# EAGLE design Arduino_MEGA_2560-Rev3_Shield (EAGLE 7.5.0)
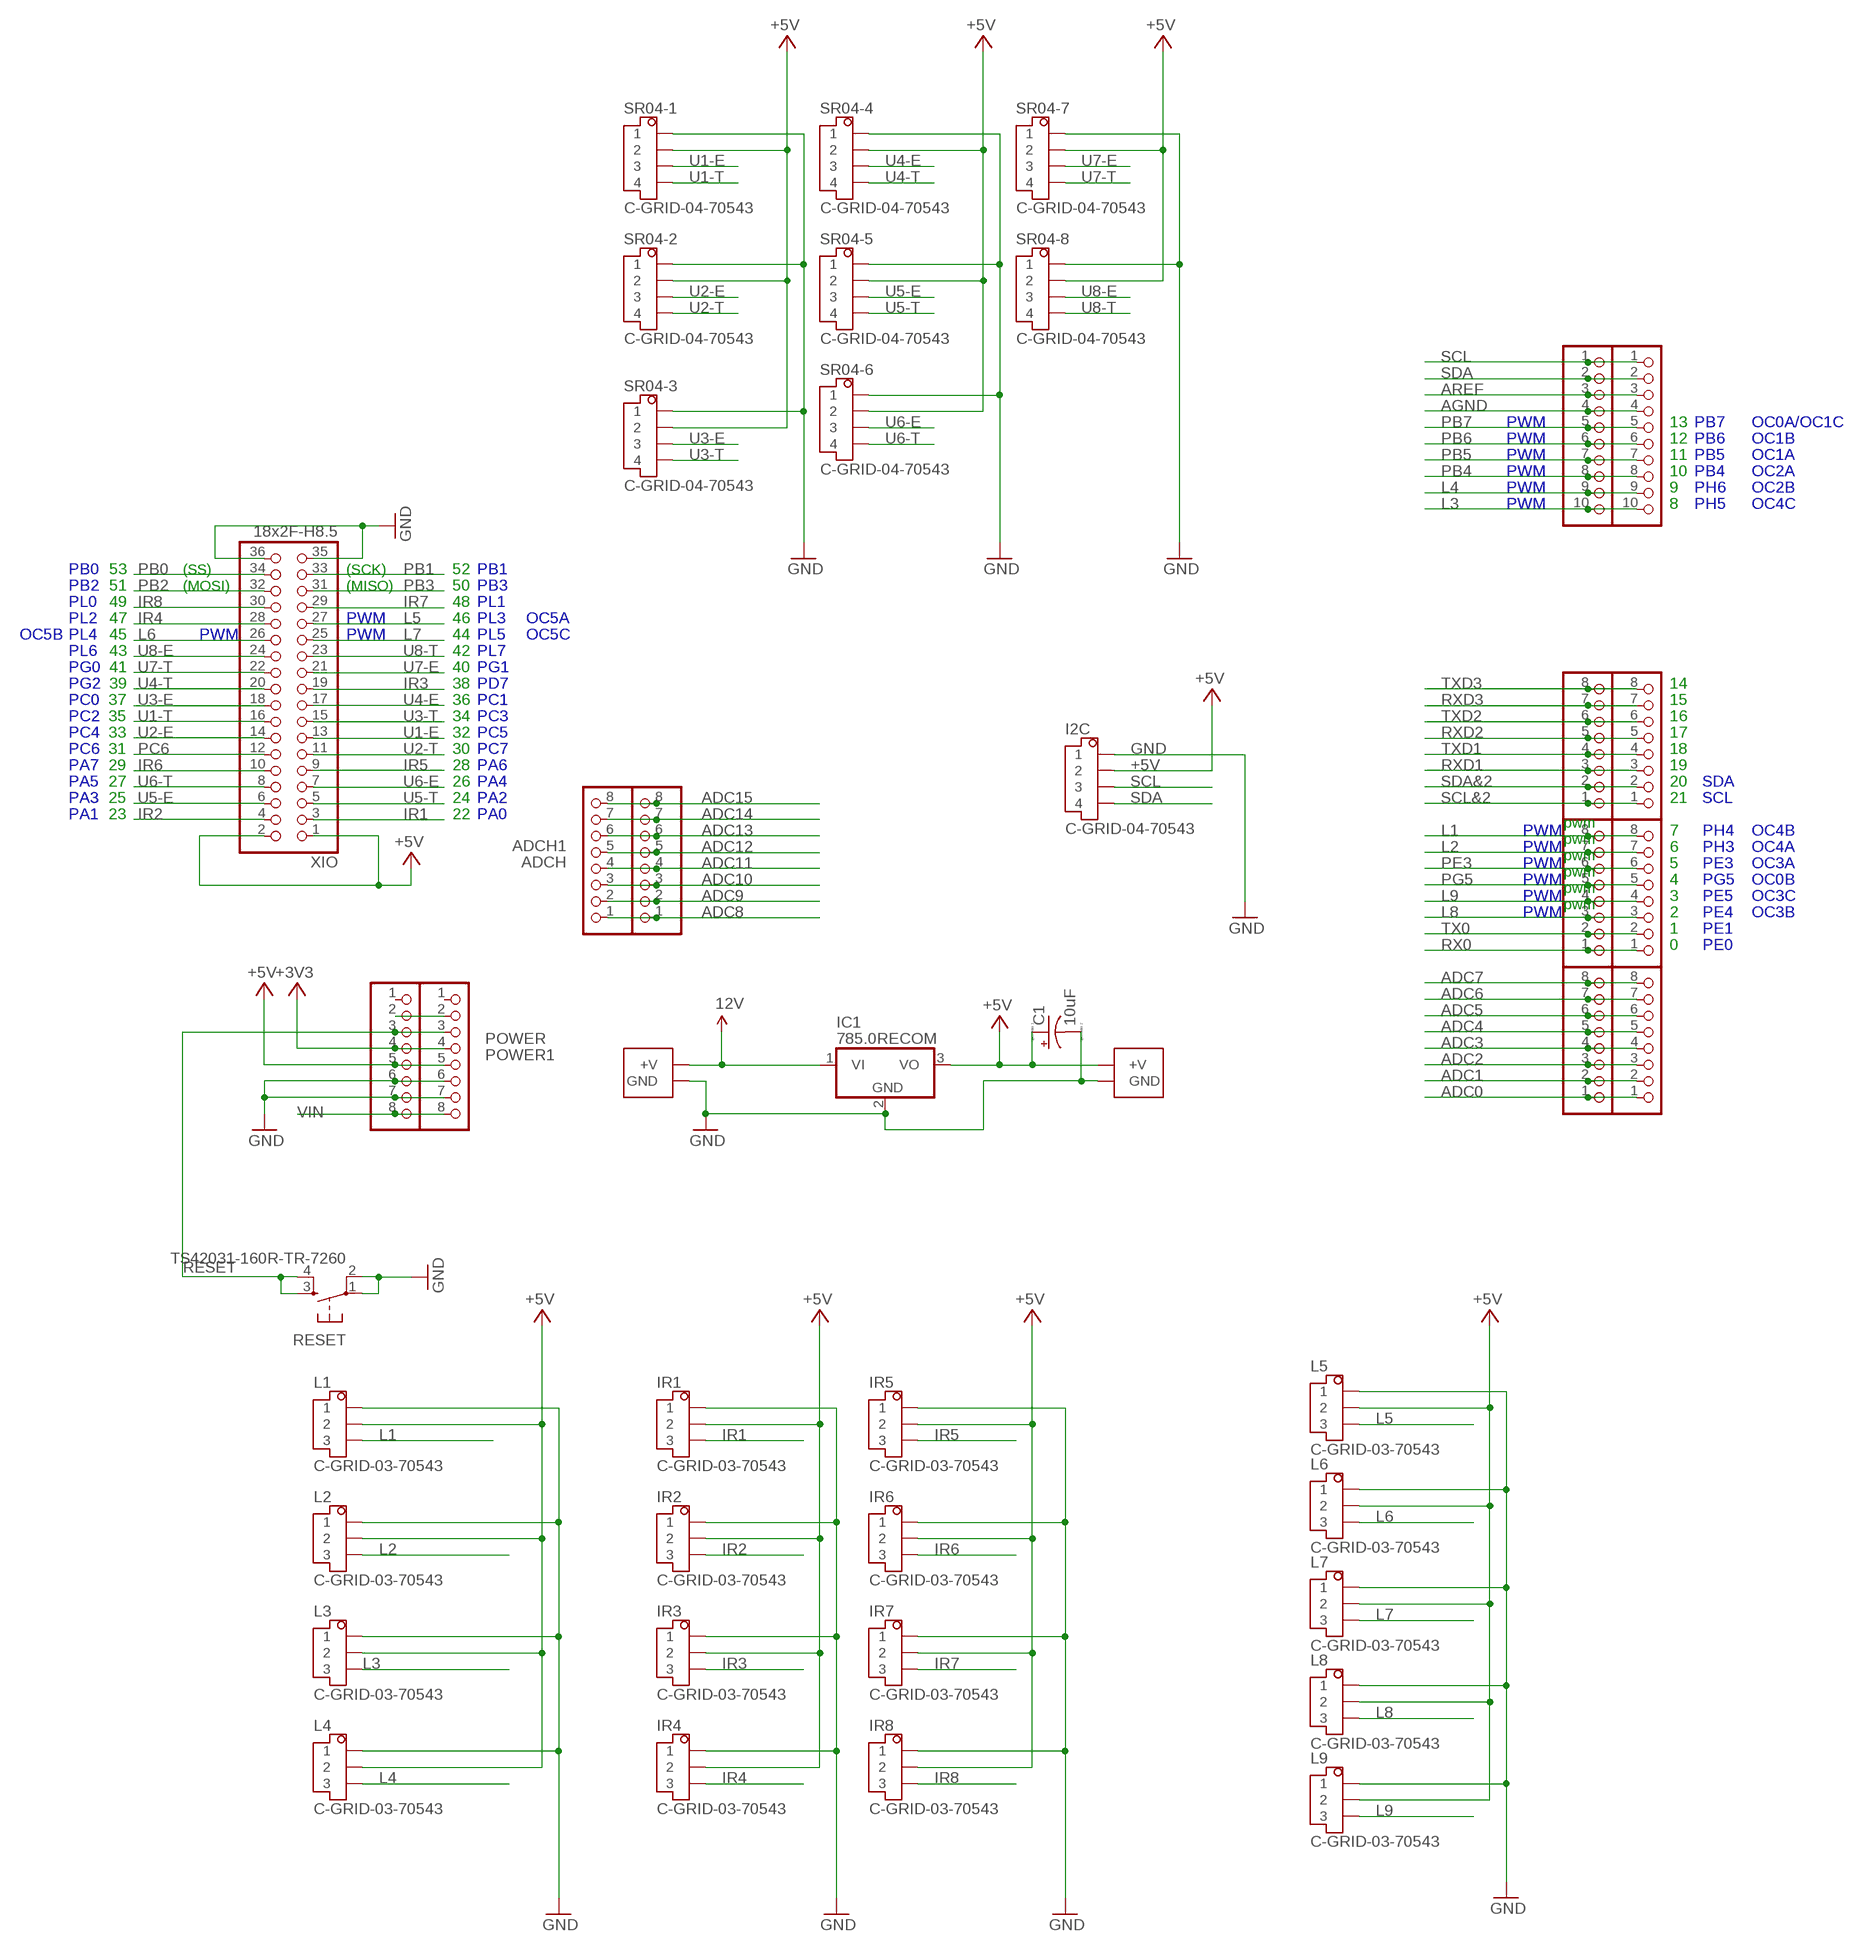
[diagram p0: schematic, sheet 1]

## Parts
ADCH  8x1F-H8.5  PINHD-1X8  [1X08]
ADCH1  8x1F-H8.5  PINHD-1X8  [1X08]
ADCL  8x1F-H8.5  PINHD-1X8  [1X08]
ADCL1  8x1F-H8.5  PINHD-1X8  [1X08]
C1  10uF  CPOL-USCT6032  [CT6032]
COMMUNICATION  8x1F-H8.5  PINHD-1X8  [1X08]
COMMUNICATION1  8x1F-H8.5  PINHD-1X8  [1X08]
I2C  C-GRID-04-70543  [70543-04]
IC1  785.0RECOM  [RECOM-78E]
IR1  C-GRID-03-70543  [70543-03]
IR2  C-GRID-03-70543  [70543-03]
IR3  C-GRID-03-70543  [70543-03]
IR4  C-GRID-03-70543  [70543-03]
IR5  C-GRID-03-70543  [70543-03]
IR6  C-GRID-03-70543  [70543-03]
IR7  C-GRID-03-70543  [70543-03]
IR8  C-GRID-03-70543  [70543-03]
JP1  10x1F-H8.5  PINHD-1X10_ARD  [1X10]
JP6  10x1F-H8.5  PINHD-1X10_ARD  [1X10]
L1  C-GRID-03-70543  [70543-03]
L2  C-GRID-03-70543  [70543-03]
L3  C-GRID-03-70543  [70543-03]
L4  C-GRID-03-70543  [70543-03]
L5  C-GRID-03-70543  [70543-03]
L6  C-GRID-03-70543  [70543-03]
L7  C-GRID-03-70543  [70543-03]
L8  C-GRID-03-70543  [70543-03]
L9  C-GRID-03-70543  [70543-03]
POWER  8x1F-H8.5  PINHD-1X8  [1X08]
POWER1  8x1F-H8.5  PINHD-1X8  [1X08]
PWML  8x1F-H8.5  PINHD-1X8  [1X08]
PWML1  8x1F-H8.5  PINHD-1X8  [1X08]
RESET  TS42031-160R-TR-7260  TAC_SWITCHPTH  [TACTILE-PTH]
SR04-1  C-GRID-04-70543  [70543-04]
SR04-2  C-GRID-04-70543  [70543-04]
SR04-3  C-GRID-04-70543  [70543-04]
SR04-4  C-GRID-04-70543  [70543-04]
SR04-5  C-GRID-04-70543  [70543-04]
SR04-6  C-GRID-04-70543  [70543-04]
SR04-7  C-GRID-04-70543  [70543-04]
SR04-8  C-GRID-04-70543  [70543-04]
U$1  POWERIN  [1825640000]
U$2  POWERIN  [1825640000]
XIO  18x2F-H8.5  PINHD-2X18  [2X18]

## Nets
12V: IC1.1(VI) U$1.B1(+V) U$1.B2(+V)
+3V3 [power]: POWER1.4 POWER.4
+5V [power usb]: C1.+ I2C.2 IC1.3(VO) IR1.2 IR2.2 IR3.2 IR4.2 IR5.2 IR6.2 IR7.2 IR8.2 L1.2 L2.2 L3.2 L4.2 L5.2 L6.2 L7.2 L8.2 L9.2 POWER1.5 POWER.5 SR04-1.2 SR04-2.2 SR04-3.2 SR04-4.2 SR04-5.2 SR04-6.2 SR04-7.2 SR04-8.2 U$2.B1(+V) U$2.B2(+V) XIO.1 XIO.2
ADC0: ADCL1.1 ADCL.1
ADC1: ADCL1.2 ADCL.2
ADC2: ADCL1.3 ADCL.3
ADC3: ADCL1.4 ADCL.4
ADC4: ADCL1.5 ADCL.5
ADC5: ADCL1.6 ADCL.6
ADC6: ADCL1.7 ADCL.7
ADC7: ADCL1.8 ADCL.8
ADC8: ADCH1.1 ADCH.1
ADC9: ADCH1.2 ADCH.2
ADC10: ADCH1.3 ADCH.3
ADC11: ADCH1.4 ADCH.4
ADC12: ADCH1.5 ADCH.5
ADC13: ADCH1.6 ADCH.6
ADC14: ADCH1.7 ADCH.7
ADC15: ADCH1.8 ADCH.8
AGND [gnd]: JP1.4 JP6.4
AREF: JP1.3 JP6.3
GND [gnd]: C1.- I2C.1 IC1.2(GND) IR1.1 IR2.1 IR3.1 IR4.1 IR5.1 IR6.1 IR7.1 IR8.1 L1.1 L2.1 L3.1 L4.1 L5.1 L6.1 L7.1 L8.1 L9.1 POWER1.6 POWER1.7 POWER.6 POWER.7 RESET.1 RESET.2 SR04-1.1 SR04-2.1 SR04-3.1 SR04-4.1 SR04-5.1 SR04-6.1 SR04-7.1 SR04-8.1 U$1.A1(GND) U$1.A2(GND) U$2.A1(GND) U$2.A2(GND) XIO.35 XIO.36
IR1: IR1.3 XIO.3
IR2: IR2.3 XIO.4
IR3: IR3.3 XIO.19
IR4: IR4.3 XIO.28
IR5: IR5.3 XIO.9
IR6: IR6.3 XIO.10
IR7: IR7.3 XIO.29
IR8: IR8.3 XIO.30
L1: L1.3 PWML1.8 PWML.8
L2: L2.3 PWML1.7 PWML.7
L3: JP1.10 JP6.10 L3.3
L4: JP1.9 JP6.9 L4.3
L5: L5.3 XIO.27
L6: L6.3 XIO.26
L7: L7.3 XIO.25
L8: L8.3 PWML1.3 PWML.3
L9: L9.3 PWML1.4 PWML.4
N$7 [power usb]: POWER1.2 POWER.2
PB0: XIO.34
PB1: XIO.33
PB2: XIO.32
PB3: XIO.31
PB4: JP1.8 JP6.8
PB5: JP1.7 JP6.7
PB6: JP1.6 JP6.6
PB7: JP1.5 JP6.5
PC6: XIO.12
PE3: PWML1.6 PWML.6
PG5: PWML1.5 PWML.5
RESET: POWER1.3 POWER.3 RESET.3 RESET.4
RX0: PWML1.1 PWML.1
RXD1: COMMUNICATION1.3 COMMUNICATION.3
RXD2: COMMUNICATION1.5 COMMUNICATION.5
RXD3: COMMUNICATION1.7 COMMUNICATION.7
SCL: I2C.3 JP1.1 JP6.1
SCL&2: COMMUNICATION1.1 COMMUNICATION.1
SDA: I2C.4 JP1.2 JP6.2
SDA&2: COMMUNICATION1.2 COMMUNICATION.2
TX0: PWML1.2 PWML.2
TXD1: COMMUNICATION1.4 COMMUNICATION.4
TXD2: COMMUNICATION1.6 COMMUNICATION.6
TXD3: COMMUNICATION1.8 COMMUNICATION.8
U1-E: SR04-1.3 XIO.13
U1-T: SR04-1.4 XIO.16
U2-E: SR04-2.3 XIO.14
U2-T: SR04-2.4 XIO.11
U3-E: SR04-3.3 XIO.18
U3-T: SR04-3.4 XIO.15
U4-E: SR04-4.3 XIO.17
U4-T: SR04-4.4 XIO.20
U5-E: SR04-5.3 XIO.6
U5-T: SR04-5.4 XIO.5
U6-E: SR04-6.3 XIO.7
U6-T: SR04-6.4 XIO.8
U7-E: SR04-7.3 XIO.21
U7-T: SR04-7.4 XIO.22
U8-E: SR04-8.3 XIO.24
U8-T: SR04-8.4 XIO.23
VIN [power]: POWER1.8 POWER.8
Unconnected: POWER1.1 POWER.1

## Notes on the sheet
- PWM | 13 | PB7 | OC0A/OC1C
- PWM | 12 | PB6 | OC1B
- PWM | 11 | PB5 | OC1A
- PWM | 10 | PB4 | OC2A
- PWM | 9 | PH6 | OC2B
- PWM | 8 | PH5 | OC4C
- PB0 | 53 | (SS) | (SCK) | 52 | PB1
- PB2 | 51 | (MOSI) | (MISO) | 50 | PB3
- PL0 | 49 | 48 | PL1
- PL2 | 47 | PWM | 46 | PL3 | OC5A
- OC5B | PL4 | 45 | PWM | PWM | 44 | PL5 | OC5C
- PL6 | 43 | 42 | PL7
- PG0 | 41 | 40 | PG1
- PG2 | 39 | 38 | PD7 | 14
- PC0 | 37 | 36 | PC1 | 15
- PC2 | 35 | 34 | PC3 | 16
- PC4 | 33 | 32 | PC5 | 17
- PC6 | 31 | 30 | PC7 | 18
- PA7 | 29 | 28 | PA6 | 19
- PA5 | 27 | 26 | PA4 | 20 | SDA
- PA3 | 25 | 24 | PA2 | 21 | SCL
- PA1 | 23 | 22 | PA0
- pwm
- PWM | 7 | PH4 | OC4B
- pwm
- PWM | 6 | PH3 | OC4A
- pwm
- PWM | 5 | PE3 | OC3A
- pwm
- PWM | 4 | PG5 | OC0B
- pwm
- PWM | 3 | PE5 | OC3C
- pwm
- PWM | 2 | PE4 | OC3B
- 1 | PE1
- 0 | PE0

## Library data of the parts
ADCH ADCH1 ADCL ADCL1 COMMUNICATION COMMUNICATION1 POWER POWER1 PWML PWML1 = SmartPrj:PINHD-1X8: PIN HEADER
C1 = resistor:CPOL-US: POLARIZED CAPACITOR, American symbol
I2C SR04-1-SR04-8 = con-molex:C-GRID-04: CONNECTOR wire to board 2.54 mm (0.100") pitch header; OC_FARNELL: unknown; OC_NEWARK: unknown
IC1 = linear:78*: Positive VOLTAGE REGULATOR Source: http://cache.national.com/ds/LM/LM78L05.pdf http://www.fairchildsemi.com/ds/LM/LM7805.pdf
IR1-IR8 L1-L9 = con-molex:C-GRID-03: CONNECTOR wire to board 2.54 mm (0.100") pitch header; OC_FARNELL: unknown; OC_NEWARK: unknown
JP1 JP6 = SmartPrj:PINHD-1X10_ARD: PIN HEADER
RESET = SparkFun-Retired:TAC_SWITCH: Momentary Switch Button commonly used for reset or general input. Spark Fun Electronics SKU : COM-00097 SMT- SWCH-08247
U$1 U$2 = PowerConnectors:POWERIN
XIO = SmartPrj:PINHD-2X18: PIN HEADER

## Net classes
0 default: width 0.203 mm, drill 0.406 mm, clearance 0.203 mm
1 power: width 0.61 mm, drill 0.406 mm, clearance 0.203 mm
2 gnd: width 0.305 mm, drill 0.406 mm, clearance 0.203 mm
3 power usb: width 0.508 mm, drill 0.406 mm, clearance 0.203 mm

## Board
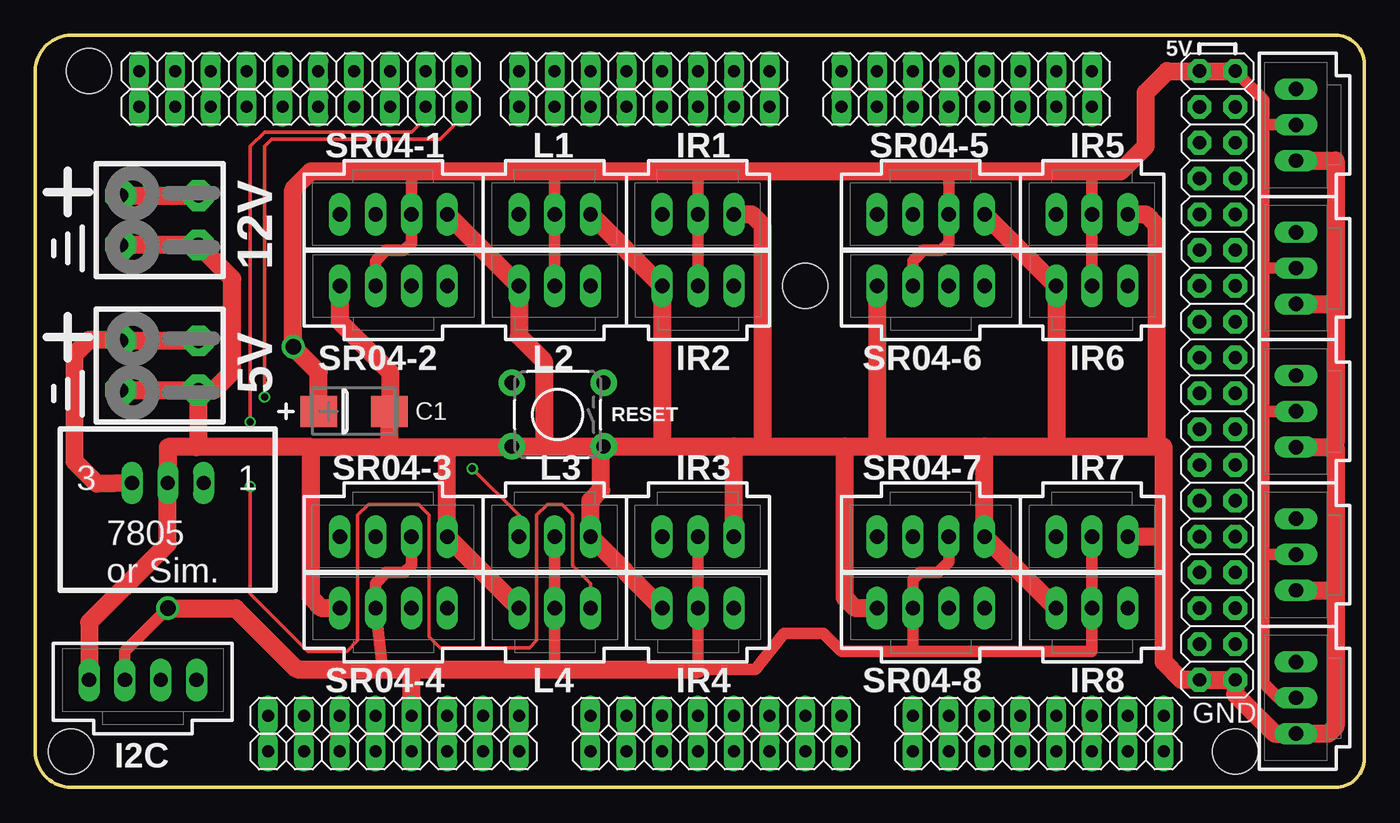
[diagram p1: board, top side]
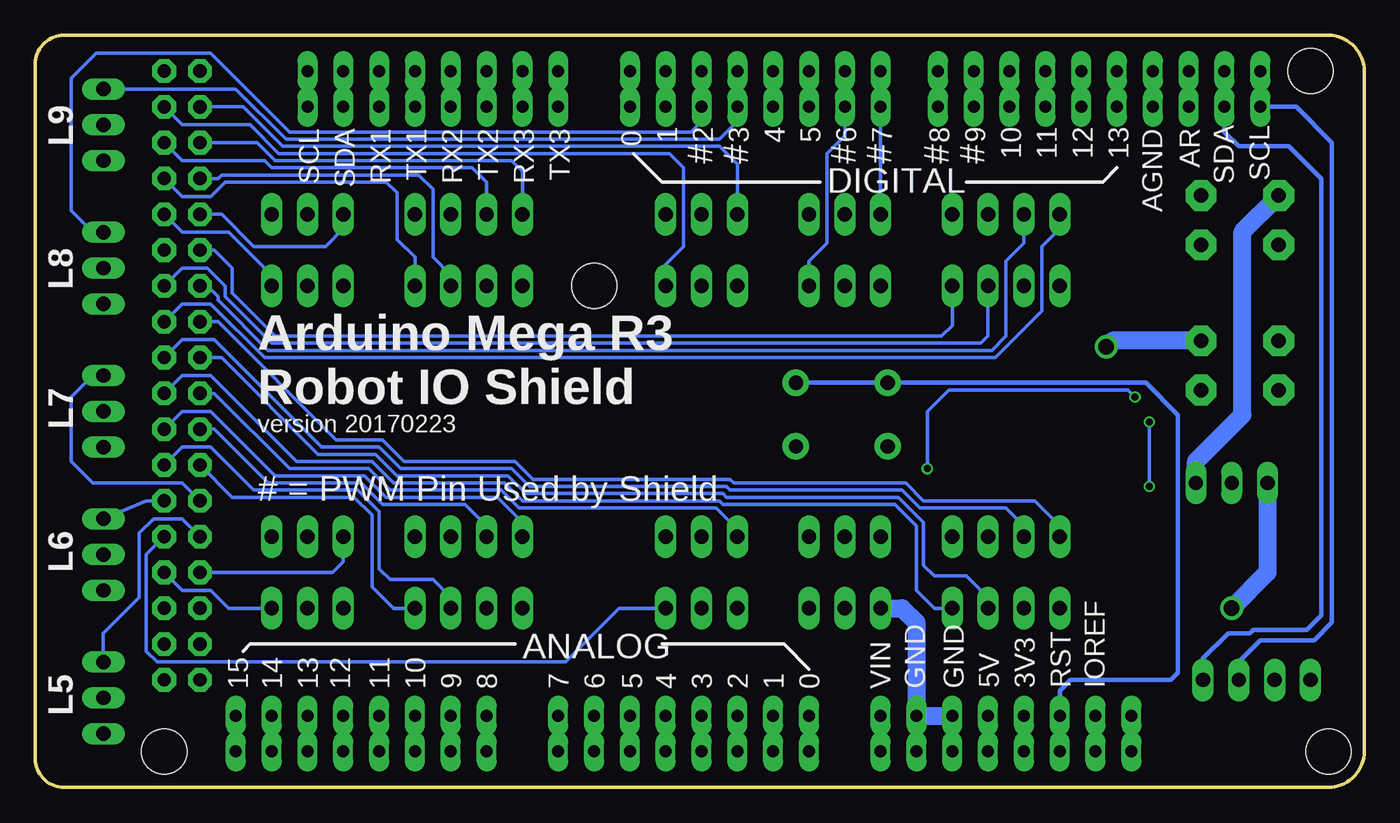
[diagram p2: board, bottom side, seen from below]

Size 94.23 x 53.34 mm. Coordinates in mm from the lower left corner, seen from the top.
Outline: 2.54,0 92.2,0 arc90 94.23,2.03 94.23,51.31 arc90 92.2,53.34 2.54,53.34 arc90 0,50.8 0,2.54 arc90 2.54,0
Copper layers (1*16): Top 0.035mm / dielectric 1.6mm / Bottom 0.035mm
Design rules "Elecrow_2-layer_PCB_eagle_rule": minimum track width 6mil, minimum drill 12mil, track to track 6mil, track to pad 6mil, pad to pad 6mil, via to via 8mil, smd to smd 0mil, copper to edge 20mil, drill to drill 10mil, minimum pad ring 6mil, minimum via ring 6mil, stop-mask expansion 0mil, vias tented up to drill 100mil, thermal gap 10mil
Holes 3.2 mm at 85.09,2.54 3.81,50.8 2.54,2.54 54.61,35.56

### Footprints (pad centres in the part's own frame; a part is rotated, then mirrored left to right if it is on the bottom)
1X08 = drill 0.85 pad 1.422 long: 1 -8.89,0; 2 -6.35,0; 3 -3.81,0; 4 -1.27,0; 5 1.27,0; 6 3.81,0; 7 6.35,0; 8 8.89,0
CT6032 = smd 2.6 x 2.2: + -2.5,0; - 2.5,0
70543-04 = drill 1.016 long: 1 -3.81,0; 2 -1.27,0; 3 1.27,0; 4 3.81,0
RECOM-78E = drill 1 long: 1 -2.54,0; 2 0,0; 3 2.54,0
70543-03 = drill 1.016 long: 1 -2.54,0; 2 0,0; 3 2.54,0
1X10 = drill 0.85 pad 1.422 long: 1 -11.43,0; 2 -8.89,0; 3 -6.35,0; 4 -3.81,0; 5 -1.27,0; 6 1.27,0; 7 3.81,0; 8 6.35,0; 9 8.89,0; 10 11.43,0
TACTILE-PTH = drill 1.016 pad 1.88: 1 -3.251,2.261; 2 3.251,2.261; 3 -3.251,-2.261; 4 3.251,-2.261
1825640000 = drill 1.016 pad 2.184 octagon: A1 -1.75,2.75; A2 -1.75,-2.75; B1 1.75,2.75; B2 1.75,-2.75
2X18 = drill 0.95 pad 1.676 octagon: 1 -21.59,-1.27; 2 -21.59,1.27; 3 -19.05,-1.27; 4 -19.05,1.27; 5 -16.51,-1.27; 6 -16.51,1.27; 7 -13.97,-1.27; 8 -13.97,1.27; 9 -11.43,-1.27; 10 -11.43,1.27; 11 -8.89,-1.27; 12 -8.89,1.27; 13 -6.35,-1.27; 14 -6.35,1.27; 15 -3.81,-1.27; 16 -3.81,1.27; 17 -1.27,-1.27; 18 -1.27,1.27; 19 1.27,-1.27; 20 1.27,1.27; 21 3.81,-1.27; 22 3.81,1.27; 23 6.35,-1.27; 24 6.35,1.27; 25 8.89,-1.27; 26 8.89,1.27; 27 11.43,-1.27; 28 11.43,1.27; 29 13.97,-1.27; 30 13.97,1.27; 31 16.51,-1.27; 32 16.51,1.27; 33 19.05,-1.27; 34 19.05,1.27; 35 21.59,-1.27; 36 21.59,1.27

### Placement (x,y rotation side)
ADCH  71.12,2.54 0 top
ADCH1  71.12,5.08 0 top
ADCL  48.26,2.54 0 top
ADCL1  48.26,5.08 0 top
C1  22.61,26.67 0 top
COMMUNICATION  66.04,50.8 180 top
COMMUNICATION1  66.04,48.26 180 top
I2C  7.62,7.62 0 top
IC1  9.4,21.59 180 top
IR1  46.99,40.64 180 top
IR2  46.99,35.56 0 top
IR3  46.99,17.78 180 top
IR4  46.99,12.7 0 top
IR5  74.93,40.64 180 top
IR6  74.93,35.56 0 top
IR7  74.93,17.78 180 top
IR8  74.93,12.7 0 top
JP1  18.8,48.26 0 top
JP6  18.8,50.8 0 top
L1  36.83,40.64 180 top
L2  36.83,35.56 0 top
L3  36.83,17.78 180 top
L4  36.83,12.7 0 top
L5  89.41,6.35 90 top
L6  89.41,16.51 90 top
L7  89.41,26.67 90 top
L8  89.41,36.83 90 top
L9  89.41,46.99 90 top
POWER  25.4,2.54 0 top
POWER1  25.4,5.08 0 top
PWML  43.18,50.8 180 top
PWML1  43.18,48.26 180 top
RESET  37.05,26.44 180 top
SR04-1  25.4,40.64 180 top
SR04-2  25.4,35.56 0 top
SR04-3  25.4,17.78 180 top
SR04-4  25.4,12.7 0 top
SR04-5  63.5,40.64 180 top
SR04-6  63.5,35.56 0 top
SR04-7  63.5,17.78 180 top
SR04-8  63.5,12.7 0 top
U$1  8.82,40.23 90 top
U$2  8.82,29.92 90 top
XIO  83.82,29.21 270 top

### Tracks (layer width: path | path; a pad name or v marks a point on that pad's centre or on a via)
12V
  Top 1.27: U$1.B1 U$1.B2
  Bottom 1.27: IC1.1 11.94,23.11 8.64,26.42 8.64,39.41 U$1.B1
+3V3
  Top 1.27: POWER.4 POWER1.4
+5V  (via drill 1.1)
  Top 0.813: XIO.2 87.12,48.77 87.12,46.99 | 87.12,46.99 L9.2 | L8.2 87.12,36.83 | 87.12,36.83 87.12,46.99 | L7.2 87.12,26.67 | 87.12,26.67 87.12,36.83 | L6.2 87.12,16.51 | 87.12,16.51 87.12,26.67 | L5.2 88.14,6.35 87.12,7.37 87.12,16.51 | SR04-2.2 24.13,37.34 24.89,38.1 26.16,38.1 26.67,38.61 SR04-1.2 26.67,43.69 | L2.2 L1.2 36.83,43.69 | IR2.2 IR1.2 46.99,43.69 | SR04-6.2 62.23,37.34 62.99,38.1 64.26,38.1 64.77,38.61 SR04-5.2 64.77,43.69 | IR6.2 IR5.2 74.93,43.69 | IR7.2 IR8.2 74.93,9.65 62.23,9.65 | SR04-7.2 64.77,16 64.01,15.24 62.74,15.24 62.23,14.73 SR04-8.2 62.23,9.65 | IR3.2 IR4.2 46.99,8.38 51.05,8.38 53.09,10.92 55.88,10.92 57.15,9.65 62.23,9.65 | 36.83,8.38 L4.2 L3.2 | 24.64,8.38 SR04-4.2 24.13,14.48 24.89,15.24 26.16,15.24 26.67,15.75 SR04-3.2 | I2C.2 6.35,9.65 v9.4,12.7
  Top 1.27: POWER.5 POWER1.5 26.67,8.38 | XIO.2 XIO.1 80.26,50.8 78.74,49.28 78.74,45.47 76.96,43.69 74.93,43.69 64.77,43.69 46.99,43.69 36.83,43.69 26.67,43.69 19.56,43.69 18.29,42.42 v18.29,31.24 20.11,29.42 C1.+ | U$2.B2 U$2.B1 5.99,31.75 3.81,31.75 2.79,30.73 2.79,23.11 4.38,21.52 IC1.3 | v9.4,12.7 14.22,12.7 18.54,8.38 24.64,8.38 26.67,8.38 | 26.67,8.38 36.83,8.38 46.99,8.38
  Bottom 1.27: U$2.B2 17.86,31.67 v18.29,31.24 | IC1.3 6.86,15.24 v9.4,12.7
ADC0
  Top 1.27: ADCL.1 ADCL1.1
ADC1
  Top 1.27: ADCL.2 ADCL1.2
ADC2
  Top 1.27: ADCL.3 ADCL1.3
ADC3
  Top 1.27: ADCL.4 ADCL1.4
ADC4
  Top 1.27: ADCL.5 ADCL1.5
ADC5
  Top 1.27: ADCL.6 ADCL1.6
ADC6
  Top 1.27: ADCL.7 ADCL1.7
ADC7
  Top 1.27: ADCL.8 ADCL1.8
ADC8
  Top 1.27: ADCH.1 ADCH1.1
ADC9
  Top 1.27: ADCH.2 ADCH1.2
ADC10
  Top 1.27: ADCH.3 ADCH1.3
ADC11
  Top 1.27: ADCH.4 ADCH1.4
ADC12
  Top 1.27: ADCH.5 ADCH1.5
ADC13
  Top 1.27: ADCH.6 ADCH1.6
ADC14
  Top 1.27: ADCH.7 ADCH1.7
ADC15
  Top 1.27: ADCH.8 ADCH1.8
AGND
  Top 1.27: JP6.4 JP1.4
AREF
  Top 1.27: JP6.3 JP1.3
GND
  Top 1.27: POWER.6 POWER1.6 | POWER.7 POWER1.7 | L6.1 92.2,13.97 | 92.2,13.97 92.2,4.32 91.69,3.81 L5.1 87.88,3.81 85.09,6.6 XIO.36 XIO.35 81.28,7.62 80.01,8.89 80.01,17.78 | L7.1 91.95,24.13 | 91.95,24.13 92.2,24.13 92.2,13.97 | L8.1 92.2,34.29 | 92.2,34.29 92.2,24.38 91.95,24.13 | L9.1 92.2,44.45 92.2,34.29 | 80.01,17.78 80.01,24.13 79.97,24.18 79.25,24.18 | RESET.1 44.45,24.18 | 44.45,24.18 49.53,24.18 | 49.53,24.18 51.56,24.18 | 51.56,24.18 57.4,24.18 | 57.4,24.18 59.94,24.18 | 59.94,24.18 67.31,24.18 | 67.31,24.18 72.39,24.18 | 72.39,24.18 79.25,24.18 | IR7.1 80.01,17.78 | IR8.1 SR04-7.1 67.31,24.18 | SR04-8.1 58.17,12.7 57.4,13.46 57.4,24.18 | IR3.1 49.53,24.18 | RESET.1 40.13,24.01 40.13,21.08 39.37,20.32 L3.1 IR4.1 | 36.32,24.18 RESET.2 33.75,24.13 29.21,24.13 | 36.32,24.18 RESET.1 | 29.21,24.13 SR04-3.1 L4.1 | SR04-4.1 20.32,12.7 19.56,13.46 19.56,24.13 | C1.- 25.11,26.16 | 25.11,26.16 25.11,24.17 | 25.11,24.17 25.15,24.13 29.21,24.13 | 19.56,24.13 25.07,24.13 25.11,24.17 | 19.56,24.13 11.43,24.13 | 11.43,24.13 9.4,24.13 IC1.2 9.4,17.27 3.81,11.68 I2C.1 | U$2.A1 U$2.A2 | U$2.A2 11.57,24.27 11.43,24.13 | U$1.A1 U$1.A2 | U$2.A2 12.68,28.17 13.97,29.46 13.97,36.07 U$1.A2 | U$1.A2 11.81,38.48 | SR04-2.1 21.59,33.02 25.15,29.46 25.15,26.2 25.11,26.16 | SR04-1.1 L2.1 34.29,32 36.07,30.23 36.07,24.43 36.32,24.18 | L1.1 IR2.1 44.45,24.18 | IR1.1 50.8,40.64 51.56,39.88 51.56,24.18 | SR04-6.1 59.69,24.43 59.94,24.18 | SR04-5.1 IR6.1 72.39,24.18 | IR5.1 78.74,40.64 79.5,39.88 79.5,24.43 79.25,24.18
  Bottom 1.27: L4.1 32.77,12.7 31.75,11.68 POWER1.7 POWER1.6
IR1
  Bottom 0.254: IR1.3 44.45,44.2 45.72,45.47 76.71,45.47 79.5,48.26 XIO.3
IR2
  Bottom 0.254: IR2.3 49.53,37.08 48.26,38.35 48.26,43.94 49.28,44.96 76.96,44.96 78.99,46.99 83.82,46.99 XIO.4
IR3
  Bottom 0.254: IR3.3 44.45,18.29 45.97,19.81 59.94,19.81 61.21,21.08 69.09,21.08 70.61,22.61 76.2,22.61 81.53,27.94 XIO.19
IR4
  Bottom 0.254: IR4.3 52.83,12.7 56.64,8.89 85.6,8.89 86.36,9.65 86.36,16.51 XIO.28
IR5
  Bottom 0.254: IR5.3 72.39,39.62 73.66,38.35 78.74,38.35 81.03,40.64 XIO.9
IR6
  Bottom 0.254: IR6.3 77.47,36.32 80.52,39.37 83.82,39.37 XIO.10
IR7
  Bottom 0.254: IR7.3 72.39,16 73.15,15.24 XIO.29
IR8
  Bottom 0.254: IR8.3 80.52,12.7 81.79,13.97 83.82,13.97 XIO.30
L1
  Top 1.27: PWML.8 PWML1.8
  Bottom 0.254: L1.3 PWML1.8
L2
  Top 1.27: PWML.7 PWML1.7
  Bottom 0.254: L2.3 39.37,37.34 38.1,38.61 38.1,44.96 36.83,46.23 PWML1.7
L3  (via drill 0.5)
  Top 0.254: L3.3 34.29,19.3 v30.99,22.61 | v16.26,27.69 16.26,45.47 16.76,45.97 28.7,45.97 30.23,47.5 JP1.10
  Top 1.27: JP6.10 JP1.10
  Bottom 0.254: v30.99,22.61 30.99,26.67 29.46,28.19 16.76,28.19 v16.26,27.69
L4  (via drill 0.5)
  Top 0.254: L4.3 39.37,14.48 38.1,15.75 38.1,19.3 37.34,20.07 36.32,20.07 35.56,19.3 35.56,10.41 35.05,9.91 28.7,9.91 27.94,10.67 27.94,19.3 27.18,20.07 23.62,20.07 22.86,19.3 22.86,10.41 22.1,9.65 19.3,9.65 15.24,13.72 v15.24,21.34 | v15.24,25.91 15.24,45.47 16.26,46.48 26.67,46.48 27.69,47.5 JP1.9
  Top 1.27: JP6.9 JP1.9
  Bottom 0.254: v15.24,21.34 v15.24,25.91
L5
  Bottom 0.254: L5.3 89.41,10.92 86.87,13.46 86.87,18.03 85.85,19.05 83.82,19.05 XIO.27
L6
  Bottom 0.254: L6.3 86.36,20.32 XIO.26
L7
  Bottom 0.254: XIO.25 83.82,21.59 90.17,21.59 91.69,23.11 91.69,27.69 90.17,29.21
  Bottom 0.305: 90.17,29.21 L7.3
L8
  Top 1.27: PWML.3 PWML1.3
  Bottom 0.254: L8.3 90.17,39.37 91.69,40.89 91.69,50.29 89.92,52.07 81.79,52.07 76.2,46.48 47.75,46.48 46.99,47.24 PWML1.3
L9
  Top 1.27: PWML.4 PWML1.4
  Bottom 0.254: L9.3 80.01,49.53 76.45,45.97 45.72,45.97 44.45,47.24 PWML1.4
N$7
  Top 1.27: POWER.2 POWER1.2
PB4
  Top 1.27: JP6.8 JP1.8
PB5
  Top 1.27: JP6.7 JP1.7
PB6
  Top 1.27: JP6.6 JP1.6
PB7
  Top 1.27: JP6.5 JP1.5
PE3
  Top 1.27: PWML.6 PWML1.6
PG5
  Top 1.27: PWML.5 PWML1.5
RESET
  Top 1.27: POWER.3 POWER1.3
  Bottom 0.305: RESET.3 RESET.4 15.49,28.7 13.21,26.42 13.21,8.13 13.72,7.62 20.83,7.62 21.59,6.86 POWER1.3
RX0
  Top 1.27: PWML.1 PWML1.1
RXD1
  Top 1.27: COMMUNICATION.3 COMMUNICATION1.3
RXD2
  Top 1.27: COMMUNICATION.5 COMMUNICATION1.5
RXD3
  Top 1.27: COMMUNICATION.7 COMMUNICATION1.7
SCL
  Top 1.27: JP6.1 JP1.1
  Bottom 0.305: I2C.3 8.89,8.89 7.37,10.41 3.56,10.41 2.29,11.68 2.29,45.72 4.83,48.26 JP1.1
SCL&2
  Top 1.27: COMMUNICATION.1 COMMUNICATION1.1
SDA
  Top 1.27: JP6.2 JP1.2
  Bottom 0.305: I2C.4 11.43,9.14 9.65,10.92 8.13,10.92 7.87,11.18 4.06,11.18 3.05,12.19 3.05,43.18 5.33,45.47 8.89,45.47 9.91,46.48 JP1.2
SDA&2
  Top 1.27: COMMUNICATION.2 COMMUNICATION1.2
TX0
  Top 1.27: PWML.2 PWML1.2
TXD1
  Top 1.27: COMMUNICATION.4 COMMUNICATION1.4
TXD2
  Top 1.27: COMMUNICATION.6 COMMUNICATION1.6
TXD3
  Top 1.27: COMMUNICATION.8 COMMUNICATION1.8
U1-E
  Bottom 0.254: SR04-1.3 24.13,38.61 25.4,37.34 25.4,32 26.42,30.99 77.72,30.99 81.28,34.54 81.28,34.8 82.04,35.56 XIO.13
U1-T
  Bottom 0.254: SR04-1.4 21.59,39.62 22.86,38.35 22.86,33.78 26.16,30.48 77.98,30.48 81.79,34.29 83.82,34.29 XIO.16
U2-E
  Bottom 0.254: SR04-2.3 26.67,32 27.18,31.5 77.47,31.5 80.77,34.8 80.77,35.56 82.04,36.83 83.82,36.83 XIO.14
U2-T
  Bottom 0.254: SR04-2.4 29.21,32.77 29.97,32 77.22,32 80.26,35.05 80.26,36.83 81.53,38.1 XIO.11
U3-E
  Bottom 0.254: SR04-3.3 24.13,18.54 25.4,19.81 31.5,19.81 32.77,21.08 44.96,21.08 45.21,21.34 59.18,21.34 60.45,22.61 68.33,22.61 69.85,24.13 73.91,24.13 81.53,31.75 83.82,31.75 XIO.18
U3-T
  Bottom 0.254: SR04-3.4 21.59,18.54 23.37,20.32 31.24,20.32 32.51,21.59 44.7,21.59 44.96,21.84 58.93,21.84 60.2,23.11 68.07,23.11 69.6,24.64 72.9,24.64 81.28,33.02 XIO.15
U4-E
  Bottom 0.254: SR04-4.3 26.67,13.46 28.19,14.99 30.48,14.99 31.24,15.75 31.24,18.8 33.02,20.57 45.21,20.57 45.47,20.83 59.44,20.83 60.71,22.1 68.58,22.1 70.1,23.62 74.17,23.62 81.03,30.48 XIO.17
U4-T
  Bottom 0.254: SR04-4.4 30.48,12.7 31.75,13.97 31.75,18.54 33.27,20.07 45.47,20.07 45.72,20.32 59.69,20.32 60.96,21.59 68.83,21.59 70.36,23.11 75.69,23.11 81.79,29.21 83.82,29.21 XIO.20
U5-E
  Bottom 0.254: SR04-5.3 62.23,42.93 63.25,43.94 77.47,43.94 77.98,44.45 83.82,44.45 XIO.6
U5-T
  Bottom 0.254: SR04-5.4 59.69,43.69 60.45,44.45 77.22,44.45 78.49,45.72 XIO.5
U6-E
  Bottom 0.254: SR04-6.3 64.77,36.32 66.04,37.59 66.04,42.42 67.06,43.43 81.03,43.43 81.28,43.18 XIO.7
U6-T
  Bottom 0.254: SR04-6.4 67.31,37.59 68.58,38.86 68.58,42.16 69.34,42.93 80.77,42.93 81.79,41.91 83.82,41.91 XIO.8
U7-E
  Bottom 0.254: SR04-7.3 62.23,18.54 63.75,20.07 69.6,20.07 71.12,21.59 77.72,21.59 81.53,25.4 XIO.21
U7-T
  Bottom 0.254: SR04-7.4 59.69,18.8 61.47,20.57 69.34,20.57 70.87,22.1 77.22,22.1 81.79,26.67 83.82,26.67 XIO.22
U8-E
  Bottom 0.254: SR04-8.3 64.77,13.46 66.04,14.73 69.09,14.73 69.85,15.49 69.85,19.56 71.37,21.08 78.74,21.08 81.79,24.13 83.82,24.13 XIO.24
U8-T
  Bottom 0.254: SR04-8.4 68.83,12.7 70.36,14.22 70.36,19.3 71.63,20.57 80.26,20.57 XIO.23
VIN
  Top 1.27: POWER.8 POWER1.8

### Text on the board
tPlace: 7805 / or Sim.
bPlace: Arduino Mega R3 / Robot IO Shield | version 20170223
tNames: 5V | 12V | 5V | GND
bNames: SCL | SDA | AR | AGND | 13 | 12 | 11 | 10 | 9 | 8 | 7 | 6 | 5 | 4 | 3 | 2 | 1 | 0 | TX3 | RX3 | TX2 | RX2 | TX1 | RX1 | SDA | SCL | # | # | # | # | # | # | DIGITAL | # = PWM Pin Used by Shield | ANALOG | IOREF | RST | 3V3 | 5V | GND | GND | VIN | 0 | 1 | 2 | 3 | 4 | 5 | 6 | 7 | 8 | 9 | 10 | 11 | 12 | 13 | 14 | 15